# Altium schematic sheet voltSens_sigCond.SchDoc
size A4; SheetNumber: 2; SheetTotal: 4; SPICEModelCacheTGBYDHUA: <root> / <DocumentId>TGBYDHUA</DocumentId> / </root>
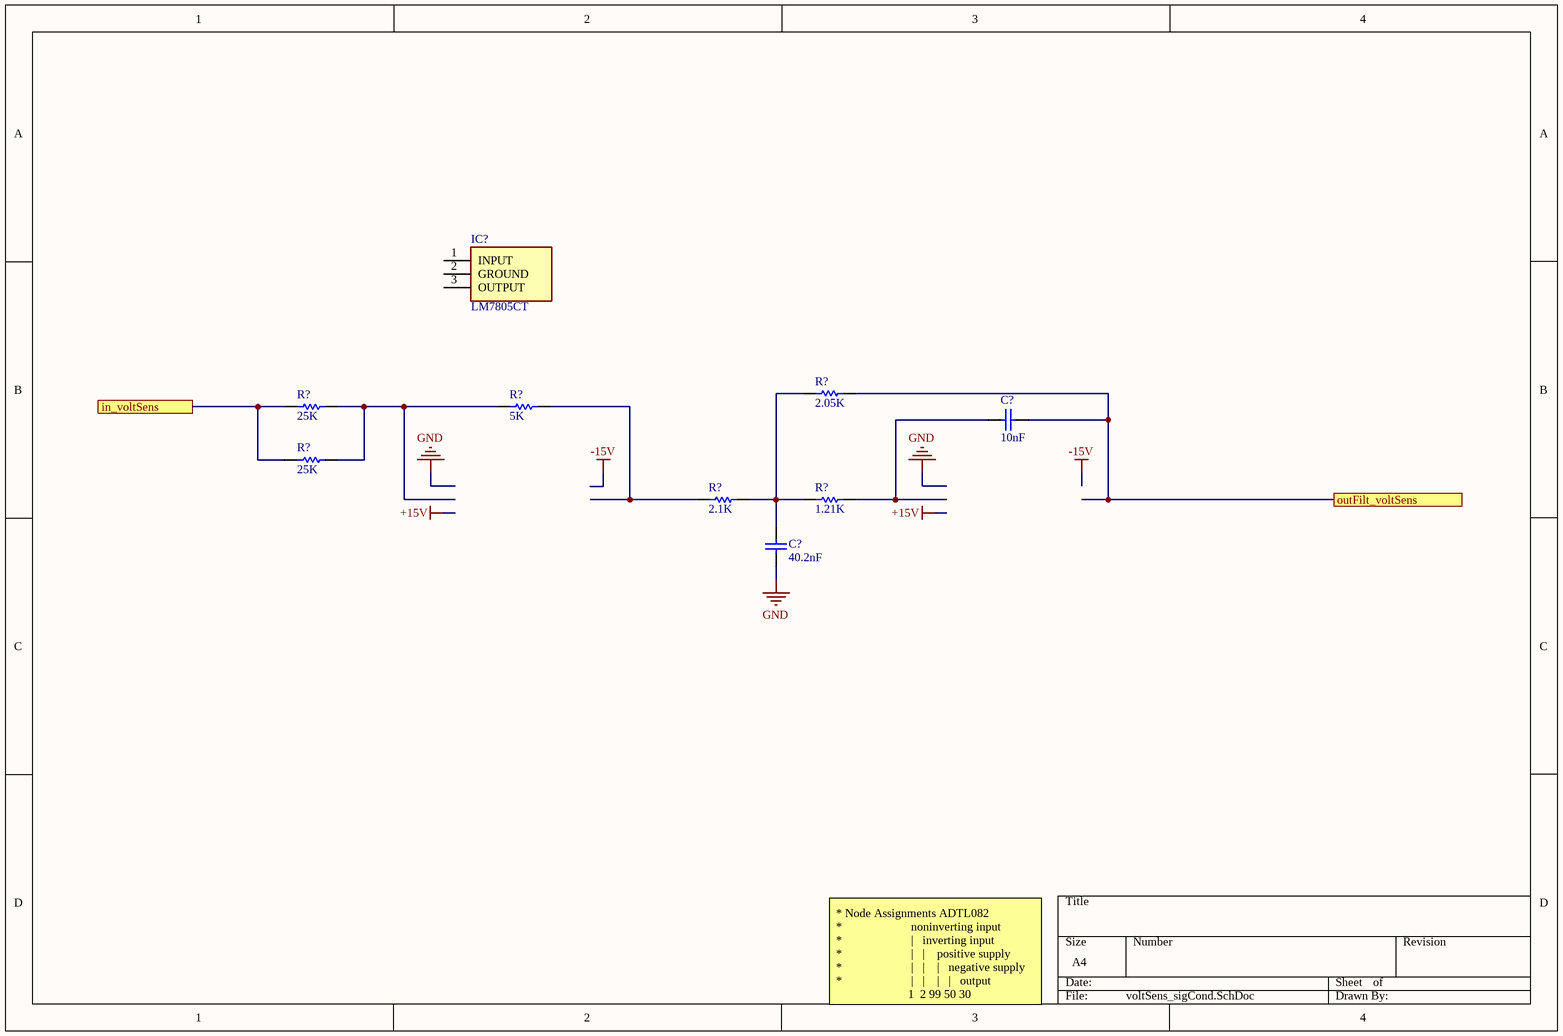
[diagram p0: voltSens_sigCond.SchDoc]

## Parts
(Parts that share a designator on the sheet are numbered #1, #2 ... from top to bottom, then left to right.)
C?#1  value 10nF  (hidden comment: Capacitor)
C?#2  value 40.2nF  (hidden comment: Capacitor)
IC?  LM7805CT  [TO254P470X1028X1955-3P]
R?#1  value 2.05K  (hidden comment: Resistor)
R?#2  value 25K  (hidden comment: Resistor)
R?#3  value 5K  (hidden comment: Resistor)
R?#4  value 25K  (hidden comment: Resistor)
R?#5  value 2.1K  (hidden comment: Resistor)
R?#6  value 1.21K  (hidden comment: Resistor)

## Ports
in_voltSens, outFilt_voltSens

## Nets
GND: C?#2.1
in_voltSens: R?#2.1 R?#4.1 ; port in_voltSens
outFilt_voltSens: C?#1.2 R?#1.2 ; port outFilt_voltSens
NetC?#1_1: C?#1.1 R?#6.2
NetC?#2_2: C?#2.2 R?#1.1 R?#5.2 R?#6.1
NetR?#2_2: R?#2.2 R?#3.1 R?#4.2
NetR?#3_2: R?#3.2 R?#5.1

Not connected (* = marked no-connect by the designer): IC? 1(INPUT) 2(GROUND) 3(OUTPUT)

## Notes on the sheet
- * Node Assignments ADTL082
  *                       noninverting input
  *                       |   inverting input
  *                       |   |    positive supply
  *                       |   |    |   negative supply
  *                       |   |    |   |   output
  1  2 99 50 30

## Library data of the parts
C?#1 C?#2 = Capacitor: SimulationGenericComponent: True
IC? = LM7805CT: Integrated Circuit; Manufacturer_Name: Texas Instruments; Datasheet Link: http://www.ti.com/lit/ds/symlink/lm340.pdf; Height: 4.7mm; Manufacturer_Part_Number: LM7805CT; Mouser Part Number: 926-LM7805CT; Mouser Price/Stock: https://www.mouser.co.uk/ProductDetail/Texas-Instruments/LM7805CT?qs=QbsRYf82W3EaqXeMDVwIfQ%3D%3D; Arrow Part Number: LM7805CT; Arrow Price/Stock: https://www.arrow.com/en/products/lm7805ct/texas-instruments?region=europe
R?#1-R?#6 = Resistor: TC1: 0; SimulationGenericComponent: True; TC2: 0